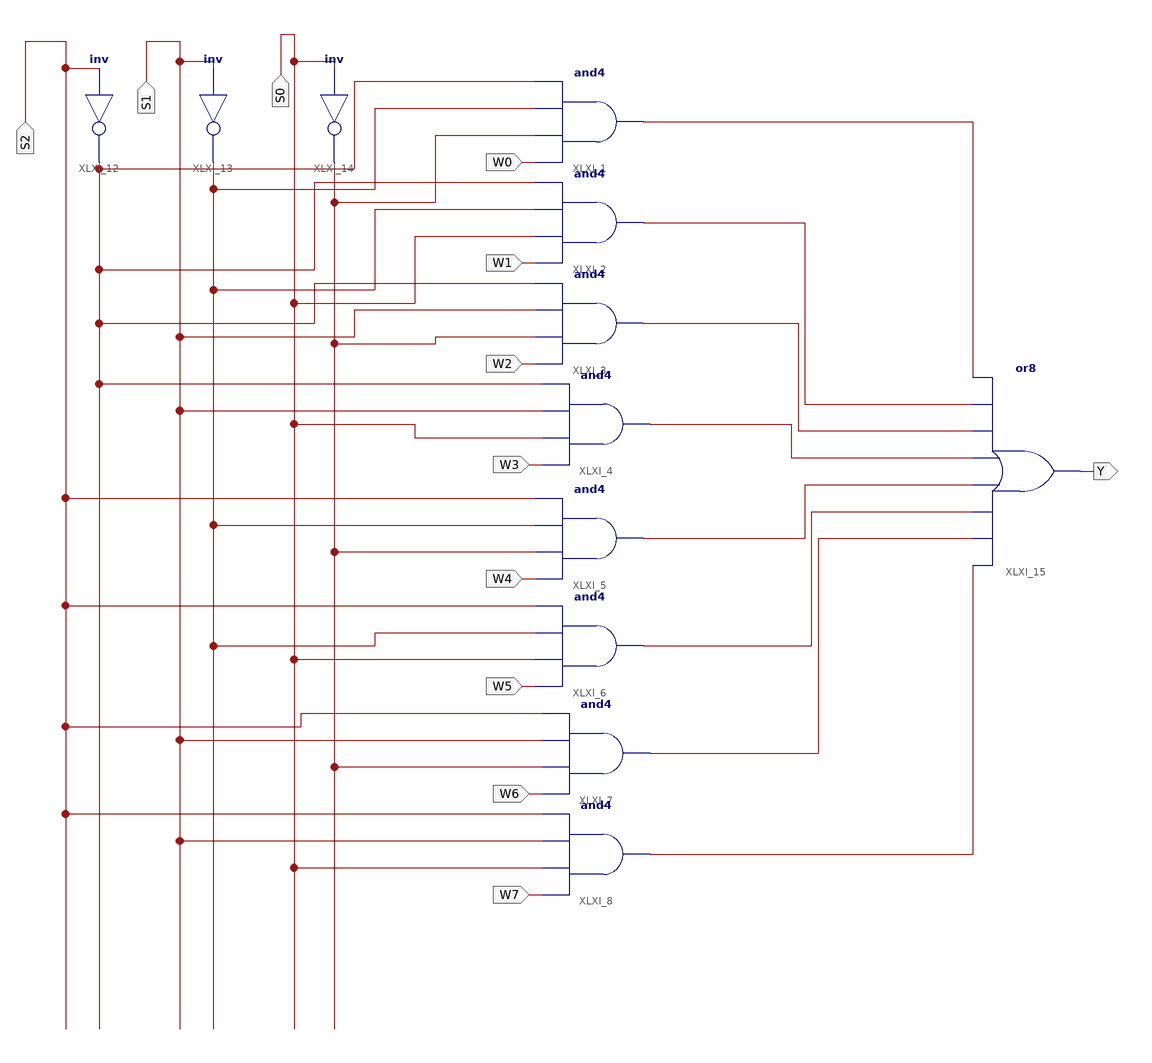
[diagram p0: schematic sheet 1]
// Xilinx ISE schematic MUX3.sch (spartan3a) as structural Verilog: 12 symbols, 12 ports
module MUX3 (
  input  S2,
  input  S1,
  input  S0,
  input  W0,
  input  W1,
  input  W2,
  input  W3,
  input  W4,
  input  W5,
  input  W6,
  input  W7,
  output Y
);

  wire XLXN_5, XLXN_6, XLXN_7, XLXN_12, XLXN_14, XLXN_15, XLXN_16, XLXN_17, XLXN_18, XLXN_19, XLXN_20;

  and XLXI_1 (XLXN_12, W0, XLXN_7, XLXN_6, XLXN_5);
  and XLXI_2 (XLXN_14, W1, S0, XLXN_6, XLXN_5);
  and XLXI_3 (XLXN_15, W2, XLXN_7, S1, XLXN_5);
  and XLXI_4 (XLXN_16, W3, S0, S1, XLXN_5);
  and XLXI_5 (XLXN_17, W4, XLXN_7, XLXN_6, S2);
  and XLXI_6 (XLXN_18, W5, S0, XLXN_6, S2);
  and XLXI_7 (XLXN_19, W6, XLXN_7, S1, S2);
  and XLXI_8 (XLXN_20, W7, S0, S1, S2);
  not XLXI_12 (XLXN_5, S2);
  not XLXI_13 (XLXN_6, S1);
  not XLXI_14 (XLXN_7, S0);
  or XLXI_15 (Y, XLXN_20, XLXN_19, XLXN_18, XLXN_17, XLXN_16, XLXN_15, XLXN_14, XLXN_12);
endmodule
